# Altium schematic sheet DCDC CONV.SchDoc
size B portrait
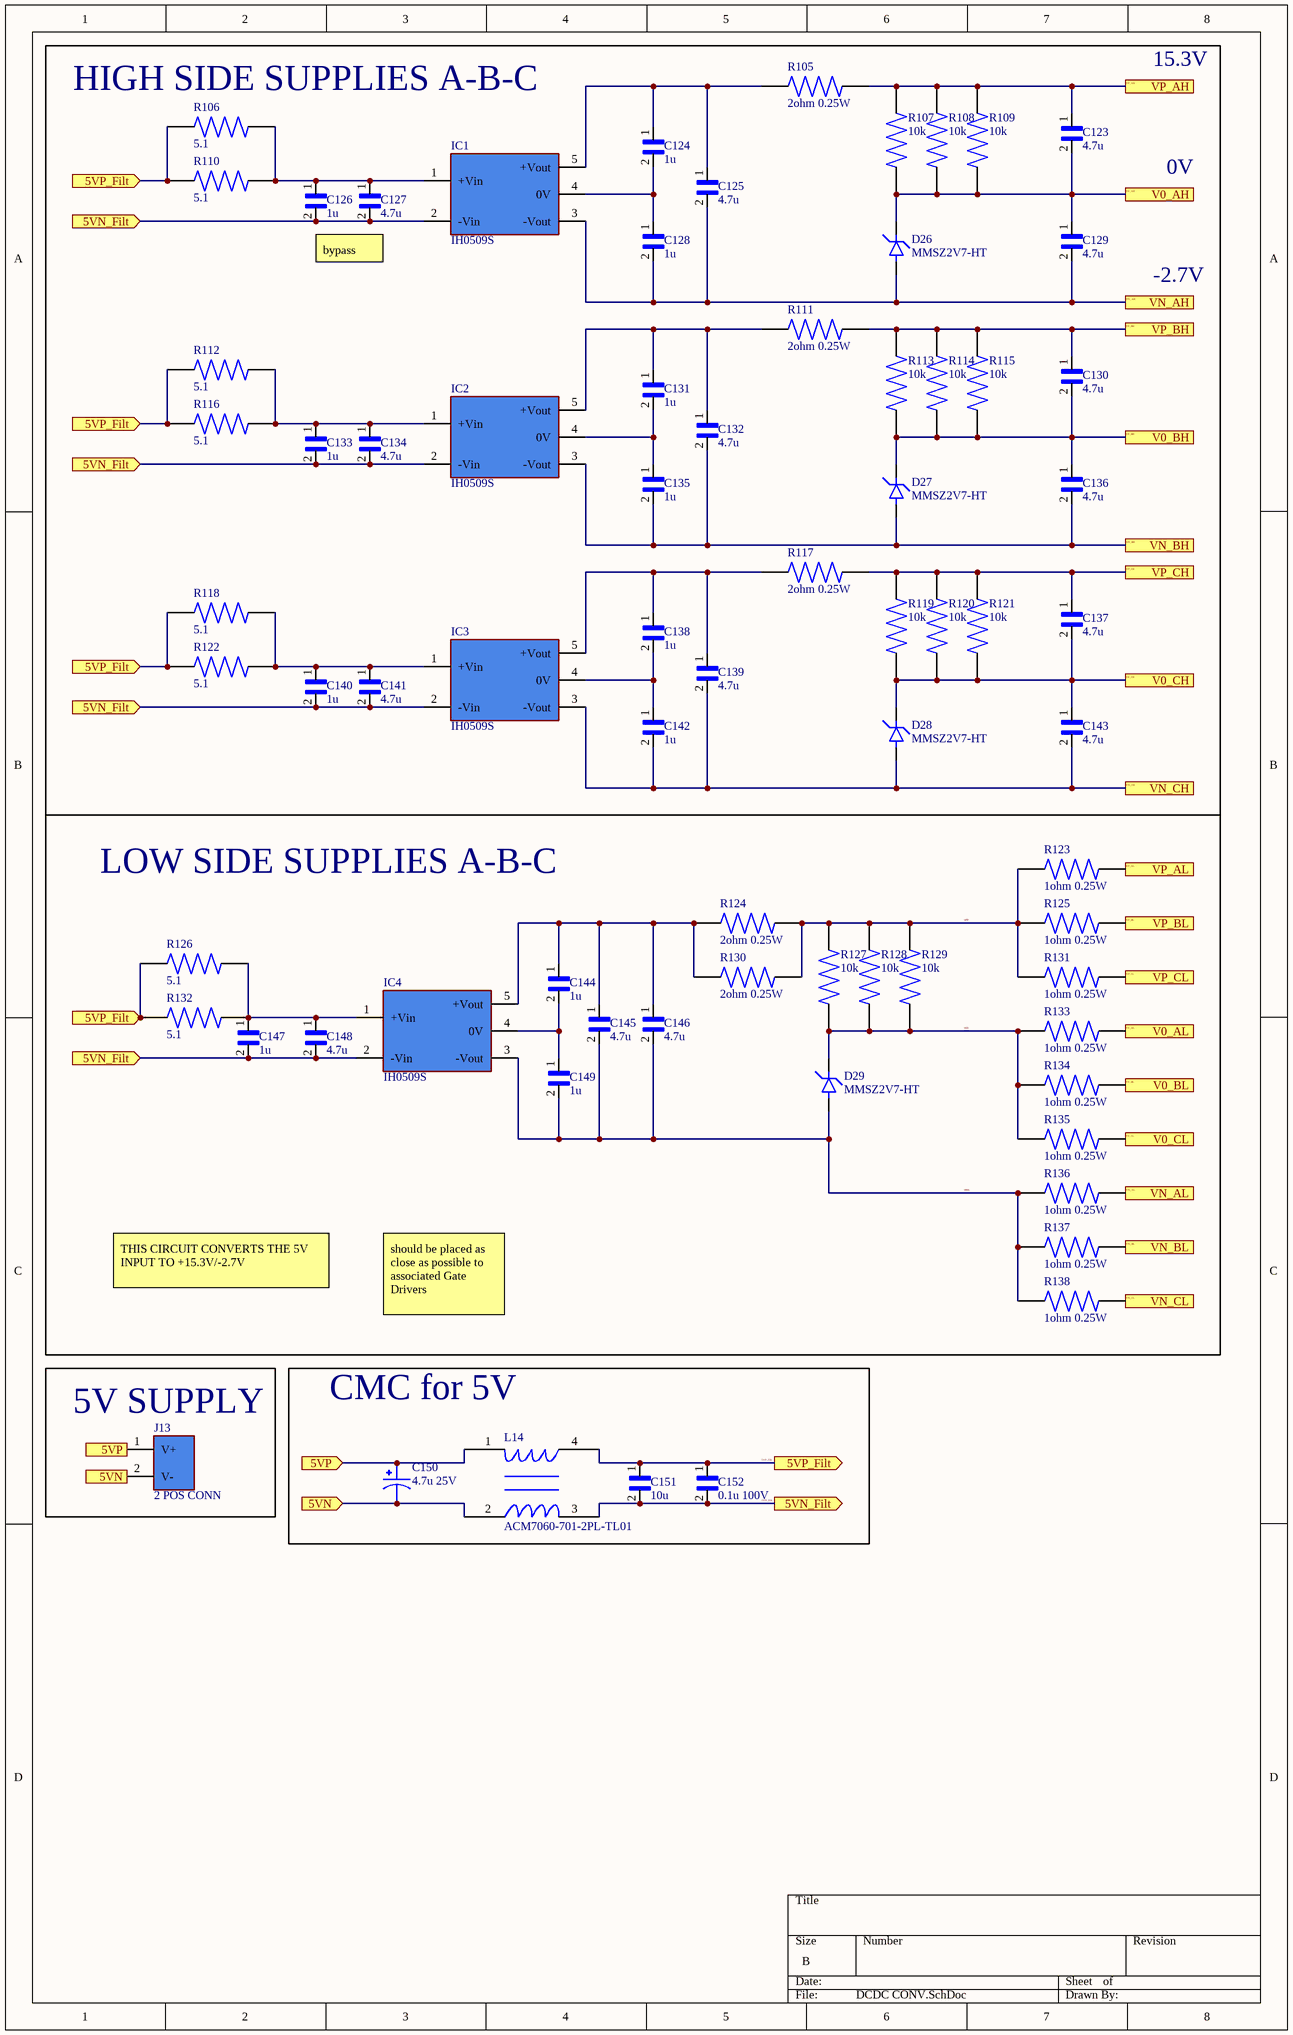
[diagram p0: DCDC CONV.SchDoc]

## Parts
C123  4.7u  [CAP 0805]
C124  1u  [CAP 0805]
C125  4.7u  [CAP 0805]
C126  1u  [CAP 0805]
C127  4.7u  [CAP 0805]
C128  1u  [CAP 0805]
C129  4.7u  [CAP 0805]
C130  4.7u  [CAP 0805]
C131  1u  [CAP 0805]
C132  4.7u  [CAP 0805]
C133  1u  [CAP 0805]
C134  4.7u  [CAP 0805]
C135  1u  [CAP 0805]
C136  4.7u  [CAP 0805]
C137  4.7u  [CAP 0805]
C138  1u  [CAP 0805]
C139  4.7u  [CAP 0805]
C140  1u  [CAP 0805]
C141  4.7u  [CAP 0805]
C142  1u  [CAP 0805]
C143  4.7u  [CAP 0805]
C144  1u  [CAP 0805]
C145  4.7u  [CAP 0805]
C146  4.7u  [CAP 0805]
C147  1u  [CAP 0805]
C148  4.7u  [CAP 0805]
C149  1u  [CAP 0805]
C150  4.7u 25V  [EEE-HC1E470XP]
C151  10u  [CAP 0805]
C152  0.1u 100V  [CAP 0805]
D26  MMSZ2V7-HT  [SOD123]
D27  MMSZ2V7-HT  [SOD123]
D28  MMSZ2V7-HT  [SOD123]
D29  MMSZ2V7-HT  [SOD123]
IC1  IH0509S  [IH0509S]
IC2  IH0509S  [IH0509S]
IC3  IH0509S  [IH0509S]
IC4  IH0509S  [IH0509S]
J13  2 POS CONN  [2POS CONN]
L14  ACM7060-701-2PL-TL01  [ACM7060-701-2PL-TL01]
R105  2ohm 0.25W  [RES 0805 (2012 metric)]
R106  5.1  [RES 0805 (2012 metric)]
R107  10k  [RES 0805 (2012 metric)]
R108  10k  [RES 0805 (2012 metric)]
R109  10k  [RES 0805 (2012 metric)]
R110  5.1  [RES 0805 (2012 metric)]
R111  2ohm 0.25W  [RES 0805 (2012 metric)]
R112  5.1  [RES 0805 (2012 metric)]
R113  10k  [RES 0805 (2012 metric)]
R114  10k  [RES 0805 (2012 metric)]
R115  10k  [RES 0805 (2012 metric)]
R116  5.1  [RES 0805 (2012 metric)]
R117  2ohm 0.25W  [RES 0805 (2012 metric)]
R118  5.1  [RES 0805 (2012 metric)]
R119  10k  [RES 0805 (2012 metric)]
R120  10k  [RES 0805 (2012 metric)]
R121  10k  [RES 0805 (2012 metric)]
R122  5.1  [RES 0805 (2012 metric)]
R123  1ohm 0.25W  [RES 0805 (2012 metric)]
R124  2ohm 0.25W  [RES 0805 (2012 metric)]
R125  1ohm 0.25W  [RES 0805 (2012 metric)]
R126  5.1  [RES 0805 (2012 metric)]
R127  10k  [RES 0805 (2012 metric)]
R128  10k  [RES 0805 (2012 metric)]
R129  10k  [RES 0805 (2012 metric)]
R130  2ohm 0.25W  [RES 0805 (2012 metric)]
R131  1ohm 0.25W  [RES 0805 (2012 metric)]
R132  5.1  [RES 0805 (2012 metric)]
R133  1ohm 0.25W  [RES 0805 (2012 metric)]
R134  1ohm 0.25W  [RES 0805 (2012 metric)]
R135  1ohm 0.25W  [RES 0805 (2012 metric)]
R136  1ohm 0.25W  [RES 0805 (2012 metric)]
R137  1ohm 0.25W  [RES 0805 (2012 metric)]
R138  1ohm 0.25W  [RES 0805 (2012 metric)]

## Blocks framed on the sheet
5V SUPPLY: J13
CMC for 5V: C150-C152 L14

## Ports
5VN (in), 5VN_Filt (in), 5VN_Filt (out), 5VP (in), 5VP_Filt (in), 5VP_Filt (out), V0_AH, V0_AL, V0_BH, V0_BL, V0_CH, V0_CL, VN_AH, VN_AL, VN_BH, VN_BL, VN_CH, VN_CL, VP_AH, VP_AL, VP_BH, VP_BL, VP_CH, VP_CL

## Nets
5VN: C150.2 J13.2(V-) L14.2 ; port 5VN
5VN_FIlt: C126.2 C127.2 C133.2 C134.2 C140.2 C141.2 C147.2 C148.2 C151.2 C152.2 IC1.2(-Vin) IC2.2(-Vin) IC3.2(-Vin) IC4.2(-Vin) L14.3 ; port 5VN_Filt
5VP: C150.1 J13.1(V+) L14.1 ; port 5VP
5VP_FIlt: C151.1 C152.1 L14.4 R106.1 R110.1 R112.1 R116.1 R118.1 R122.1 R126.1 R132.1 ; port 5VP_Filt
V00: D29.1(Cathode) R127.1 R128.1 R129.1 R133.2 R134.2 R135.2
V0_AH: C123.2 C129.1 D26.1(Cathode) R107.1 R108.1 R109.1 ; port V0_AH
V0_AL: R133.1 ; port V0_AL
V0_BH: C130.2 C136.1 D27.1(Cathode) R113.1 R114.1 R115.1 ; port V0_BH
V0_BL: R134.1 ; port V0_BL
V0_CH: C137.2 C143.1 D28.1(Cathode) R119.1 R120.1 R121.1 ; port V0_CH
V0_CL: R135.1 ; port V0_CL
VN_AH: C125.2 C128.2 C129.2 D26.2(Anode) IC1.3(-Vout) ; port VN_AH
VN_AL: R136.1 ; port VN_AL
VN_BH: C132.2 C135.2 C136.2 D27.2(Anode) IC2.3(-Vout) ; port VN_BH
VN_BL: R137.1 ; port VN_BL
VN_CH: C139.2 C142.2 C143.2 D28.2(Anode) IC3.3(-Vout) ; port VN_CH
VN_CL: R138.1 ; port VN_CL
VNN: C145.2 C146.2 C149.2 D29.2(Anode) IC4.3(-Vout) R136.2 R137.2 R138.2
VP_AH: C123.1 R105.2 R107.2 R108.2 R109.2 ; port VP_AH
VP_AL: R123.1 ; port VP_AL
VP_BH: C130.1 R111.2 R113.2 R114.2 R115.2 ; port VP_BH
VP_BL: R125.1 ; port VP_BL
VP_CH: C137.1 R117.2 R119.2 R120.2 R121.2 ; port VP_CH
VP_CL: R131.1 ; port VP_CL
VPP: R123.2 R124.2 R125.2 R127.2 R128.2 R129.2 R130.2 R131.2
NetC124_1: C124.1 C125.1 IC1.5(+Vout) R105.1
NetC124_2: C124.2 C128.1 IC1.4(0V)
NetC126_1: C126.1 C127.1 IC1.1(+Vin) R106.2 R110.2
NetC131_1: C131.1 C132.1 IC2.5(+Vout) R111.1
NetC131_2: C131.2 C135.1 IC2.4(0V)
NetC133_1: C133.1 C134.1 IC2.1(+Vin) R112.2 R116.2
NetC138_1: C138.1 C139.1 IC3.5(+Vout) R117.1
NetC138_2: C138.2 C142.1 IC3.4(0V)
NetC140_1: C140.1 C141.1 IC3.1(+Vin) R118.2 R122.2
NetC144_1: C144.1 C145.1 C146.1 IC4.5(+Vout) R124.1 R130.1
NetC144_2: C144.2 C149.1 IC4.4(0V)
NetC147_1: C147.1 C148.1 IC4.1(+Vin) R126.2 R132.2

## Notes on the sheet
- (near R106) HIGH SIDE SUPPLIES A-B-C
- 15.3V
- 0V
- bypass
- -2.7V
- LOW SIDE SUPPLIES A-B-C
- THIS CIRCUIT CONVERTS THE 5V INPUT TO +15.3V/-2.7V
- should be placed as close as possible to associated Gate Drivers

## Library data of the parts
C123 C125 C127 C129 C130 C132 C134 C136 C137 C139 C141 C143 C145 C146 C148 = 56pF 0805: 4.7u 0805
C124 C126 C128 C131 C133 C135 C138 C140 C142 C144 C147 C149 = 56pF 0805: 1u0805
C150 = EEE-HC1E4
C151 = 0.1uF 0805: 10uF
C152 = 0.1uF 0805
D26-D29 = MMSZ2V7-HT: MMSZ2V7-HT / 2.7V ZENER
R105-R138 = 120ohm 0805